# EAGLE design MAX30100_Adapter (EAGLE 7.3.0)
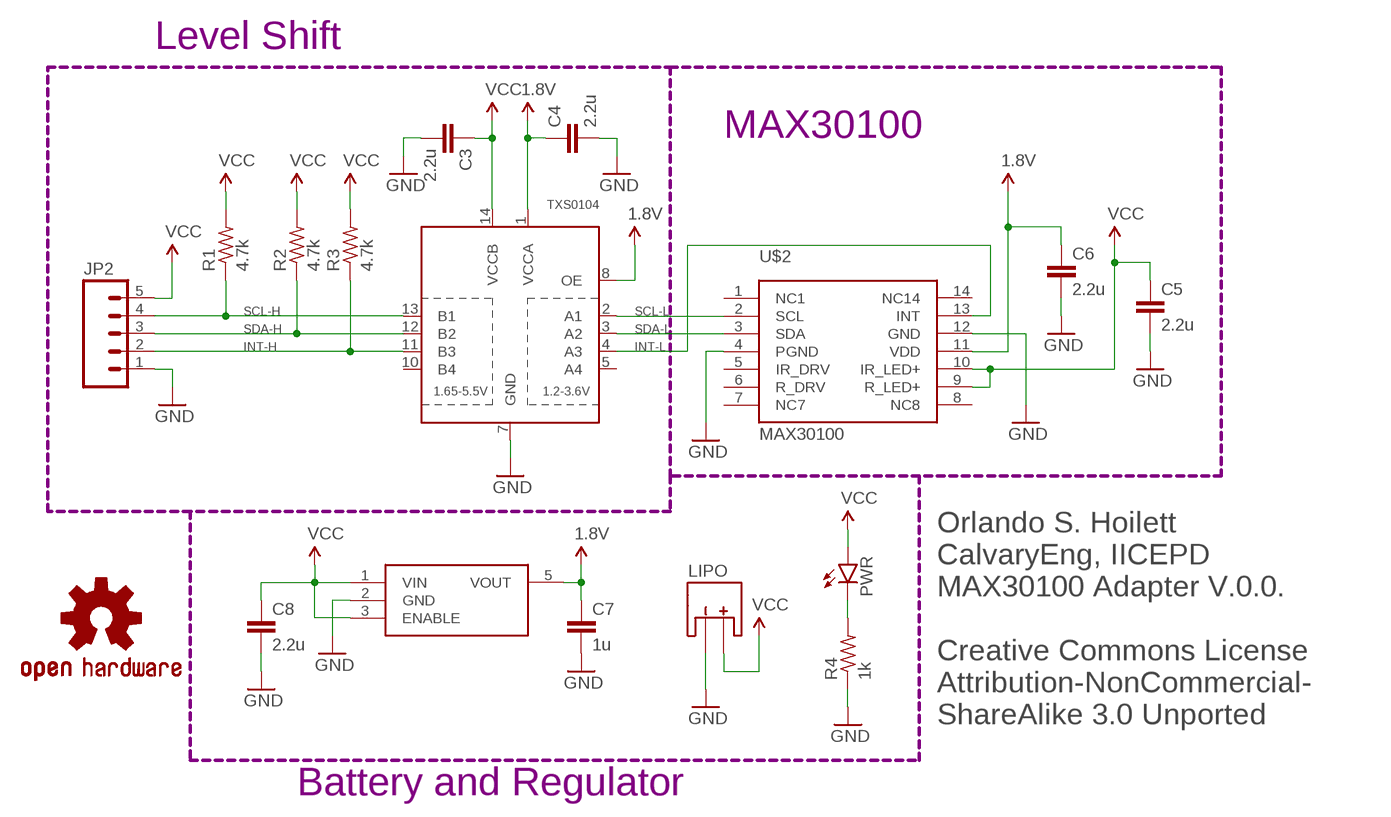
[diagram p0: schematic, sheet 1]

## Parts
C3  2.2u  C-EUC0402  [C0402]
C4  2.2u  C-EUC0402  [C0402]
C5  2.2u  C-EUC0402  [C0402]
C6  2.2u  C-EUC0402  [C0402]
C7  1u  C-EUC0402  [C0402]
C8  2.2u  C-EUC0402  [C0402]
JP2  M05NO_SILK  [1X05_NO_SILK]
LDO  MIC5504  [SOT23-5]
LIPO  JST-PTH  [JST-2-PTH-VERT]
LOGO1  OSHW-LOGOS  [OSHW-LOGO-S]
PWR  LED0603  [LED-0603]
R1  4.7k  R-US_R0402  [R0402]
R2  4.7k  R-US_R0402  [R0402]
R3  4.7k  R-US_R0402  [R0402]
R4  1k  R-US_R0402  [R0402]
TXS0104  TXB0104PWR  [TSSOP14]
U$2  MAX30100  [OESIP14]

## Nets
1.8V: C4.1 C6.1 C7.1 LDO.5(VOUT) TXS0104.1(VCCA) TXS0104.8(OE) U$2.11(VDD)
GND: C3.2 C4.2 C5.2 C6.2 C7.2 C8.2 JP2.1 LDO.2(GND) LIPO.- R4.1 TXS0104.7(GND) U$2.4(PGND) U$2.12(GND)
INT-H: JP2.2 R3.1 TXS0104.11(B3)
INT-L: TXS0104.4(A3) U$2.13(INT)
N$1: PWR.C R4.2
SCL-H: JP2.4 R1.1 TXS0104.13(B1)
SCL-L: TXS0104.2(A1) U$2.2(SCL)
SDA-H: JP2.3 R2.1 TXS0104.12(B2)
SDA-L: TXS0104.3(A2) U$2.3(SDA)
VCC: C3.1 C5.1 C8.1 JP2.5 LDO.1(VIN) LDO.3(ENABLE) LIPO.+ PWR.A R1.2 R2.2 R3.2 TXS0104.14(VCCB) U$2.9(R_LED+) U$2.10(IR_LED+)
Unconnected: TXS0104.5(A4) TXS0104.10(B4) U$2.1(NC1) U$2.5(IR_DRV) U$2.6(R_DRV) U$2.7(NC7) U$2.8(NC8) U$2.14(NC14)

## Notes on the sheet
- Level Shift
- MAX30100
- Orlando S. Hoilett
  CalvaryEng, IICEPD
  MAX30100 Adapter V.0.0.
  
  Creative Commons License
  Attribution-NonCommercial-
  ShareAlike 3.0 Unported
- Battery and Regulator

## Library data of the parts
C3-C8 = resistor:C-EU: CAPACITOR, European symbol
JP2 = SparkFun-Connectors:M05: Header 5 Standard 5-pin 0.1" header. Use with straight break away headers (SKU : PRT-00116), right angle break away headers (PRT-00553), swiss pins (PRT-00743), machine pins (PRT-00117), and female headers (PRT-00115). Molex polarized connector foot print use with SKU : PRT-08230 with associated crimp pins and housings.
LDO = OrlandoRonMod:MIC5504
LIPO = Orlando:JST-PTH
LOGO1 = SparkFun-Aesthetics:OSHW-LOGO: Open Source Hardware Logo This logo indicates the piece of hardware it is found on incorporates a OSHW license and/or adheres to the definition of open source hardware found here: http://freedomdefined.org/OSHW
PWR = SparkFun-LED:LED: LEDs Standard schematic elements and footprints for 5mm, 3mm, 1206, and 0603 sized LEDs. 5mm - Spark Fun Electronics SKU : COM-00529 (and others)
R1-R4 = resistor:R-US_: RESISTOR, American symbol
TXS0104 = SparkFun-DigitalIC:TXB0104PWR: 4-Bit Bi-Directional Level Shifter 1.2V-3.6V (VCCA) to 1.65V-5.5V (VCCB) bi-directional level shifter with auto direction sensing. Max data rate - VCCA 1.8V: 20Mbps (50ns), VCCA 3.3V: 100Mbps (10ns) Digikey: 296-21929-1-ND (TSSOP) IC-11329
U$2 = OrlandoRonMod:MAX30100

## Board
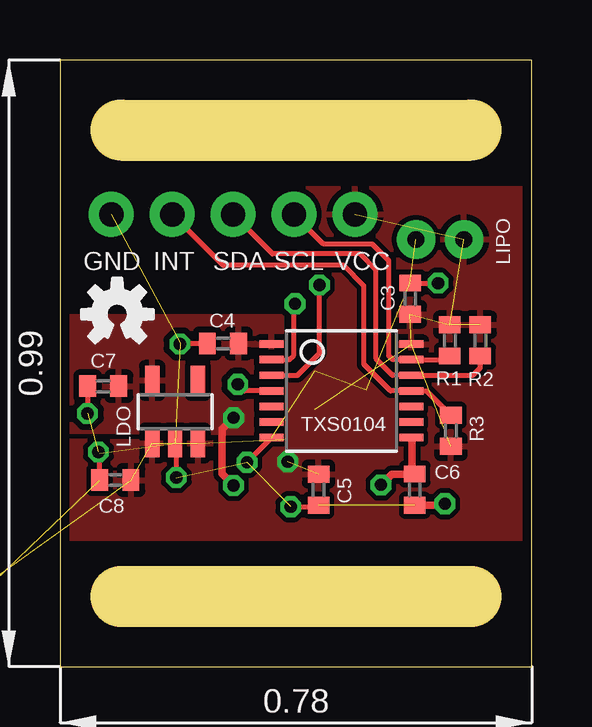
[diagram p1: board, top side]
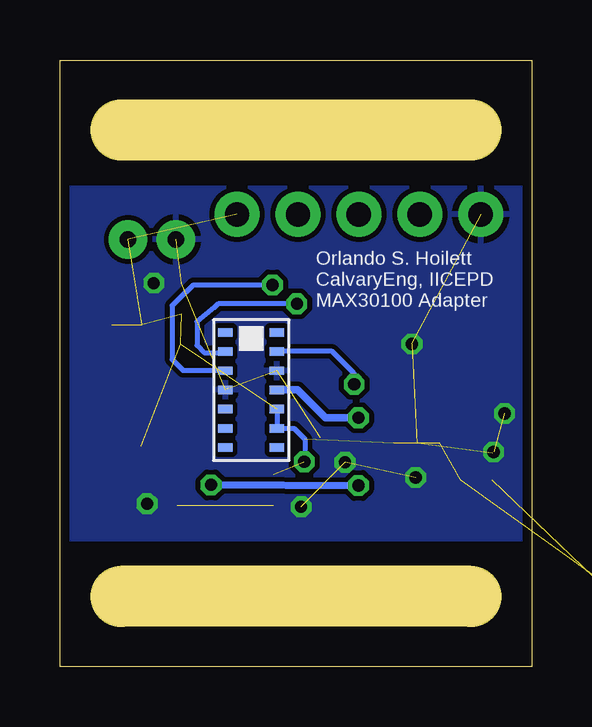
[diagram p2: board, bottom side, seen from below]

Size 19.68 x 25.27 mm. Coordinates in mm from the lower left corner, seen from the top.
Outline: 2.54,22.35 17.14,22.35
Outline: 2.54,2.92 17.14,2.92
Outline: 0,0 19.68,0 19.68,25.27 0,25.27 0,0
Copper layers (1*16): Top 0.0356mm / dielectric 1.5011mm / Bottom 0.0356mm
Design rules "LaenPCBOrder": minimum track width 6mil, minimum drill 13mil, track to track 6mil, track to pad 6mil, pad to pad 6mil, via to via 6mil, smd to smd 6mil, copper to edge 15mil, drill to drill 6mil, minimum pad ring 7mil, minimum via ring 7mil, stop-mask expansion 3mil, vias tented up to drill 0mil, thermal gap 10mil

### Footprints (pad centres in the part's own frame; a part is rotated, then mirrored left to right if it is on the bottom)
C0402 = smd 0.7 x 0.9: 1 -0.65,0; 2 0.65,0
1X05_NO_SILK = drill 1.016 pad 1.88: 1 0,0; 2 2.54,0; 3 5.08,0; 4 7.62,0; 5 10.16,0
SOT23-5 = smd 0.6 x 1.2: 1 -0.95,-1.306; 2 0,-1.306; 3 0.95,-1.306; 4 0.95,1.306; 5 -0.95,1.306
JST-2-PTH-VERT = drill 0.7 pad 1.6: + 1,-0.55; - -1,-0.55
LED-0603 = smd 1 x 1: A 0,-0.677; C 0,0.877
R0402 = smd 0.7 x 0.9: 1 -0.65,0; 2 0.65,0
TSSOP14 = smd 0.305 x 0.991: 1 -1.95,-2.918; 2 -1.3,-2.918; 3 -0.65,-2.918; 4 0,-2.918; 5 0.65,-2.918; 6 1.3,-2.918; 7 1.95,-2.918; 8 1.95,2.918; 9 1.3,2.918; 10 0.65,2.918; 11 0,2.918; 12 -0.65,2.918; 13 -1.3,2.918; 14 -1.95,2.918
OESIP14 = smd 0.6 x 0.35: 1 -1.08,2.54; 2 -1.08,1.74; 3 -1.08,0.94; 4 -1.08,0.14; 5 -1.08,-0.66; 6 -1.08,-1.46; 7 -1.08,-2.26; 8 1.07,-2.26; 9 1.07,-1.46; 10 1.07,-0.66; 11 1.07,0.14; 12 1.07,0.94; 13 1.07,1.74; 14 1.07,2.54

### Placement (x,y rotation side)
C3  14.6,15.33 90 top
C4  6.8,13.46 180 top
C5  10.78,7.37 270 top
C6  14.79,7.37 270 top
C7  1.8,11.68 180 top
C8  2.31,7.77 180 top
JP2  2.14,18.84 0 top
LDO  4.8,10.62 0 top
LIPO  15.85,18.35 0 top
LOGO1  2.39,14.68 0 top
PWR  -12.73,-2.79 0 top  (outside the outline)
R1  16.26,13.59 90 top
R2  17.53,13.59 90 top
R3  16.3,9.82 270 top
R4  -12.8,-6.68 0 top  (outside the outline)
TXS0104  11.74,11.49 270 top
U$2  11.71,11.38 0 bottom

### Tracks (layer width: path | path; a pad name or v marks a point on that pad's centre or on a via)
1.8V  (via drill 0.51)
  Top 0.305: v7.24,7.54 6.76,8.03 6.76,9.88 v7.24,10.36 | TXS0104.8 14.69,9.51 14.69,8.13 C6.1 13.84,8.02 v13.39,7.57
  Bottom 0.305: U$2.11 9.77,11.52 8.61,10.36 v7.24,10.36 | v13.39,7.57 v7.24,7.54
  pour Top (isolate 0.254): 0,14.61 9.25,14.61 9.25,9.7 0,9.78
GND  (via drill 0.51)  (12 unrouted)
  Top 0.203: LDO.2 4.85,9.31 v4.85,7.87 | TXS0104.7 v7.8,8.51 | C3.2 15.68,15.98 v15.77,15.98 | v9.63,6.65 10.72,6.65 C5.2 | C7.2 1.15,10.55 v1.14,10.54 | C8.2 1.66,8.88 v1.6,8.94 | C4.2 5.03,13.46 v5,13.44
  Top 0.305: C6.2 15.99,6.72 v16.05,6.78
  pour Bottom (isolate 0.203): 19.68,19.94 19.68,5.33 0,5.33 0,19.94
INT-H
  Top 0.203: JP2.2 6.81,16.71 11.84,16.71 12.68,15.88 12.68,12.6 13.79,11.49 TXS0104.11 15.29,11.49 R3.1
INT-L  (via drill 0.51)
  Top 0.203: TXS0104.4 7.69,11.49 v7.42,11.76
  Bottom 0.203: v7.42,11.76 7.42,12.22 8.33,13.13 10.63,13.13 U$2.13
N$1  (1 unrouted)
SCL-H
  Top 0.203: JP2.4 11,17.6 13.03,17.6 13.72,16.92 13.72,12.95 13.88,12.79 TXS0104.13 16.1,12.79 R1.1
SCL-L  (via drill 0.51)
  Top 0.203: TXS0104.2 9.56,12.79 9.75,12.98 9.75,15.06 v9.8,15.11
  Bottom 0.203: U$2.2 12.83,13.08 13.66,13.08 13.97,13.39 13.97,14.38 13.23,14.96 13.08,15.11 v9.8,15.11
SDA-H
  Top 0.203: JP2.3 8.86,17.2 12.52,17.2 13.18,16.54 13.18,12.83 13.87,12.14 TXS0104.12 17.22,12.14 17.53,12.45 R2.1
SDA-L  (via drill 0.51)
  Top 0.203: TXS0104.3 9.9,12.14 10.82,13.06 v10.82,15.9
  Bottom 0.203: U$2.3 12.81,12.34 14.55,12.34 15.01,12.8 15.01,15.04 14.43,15.62 14.4,15.62 14.12,15.9 v10.82,15.9
VCC  (via drill 0.51)  (12 unrouted)
  Bottom 0.203: U$2.10 U$2.9 9.92,9.92 9.47,9.47 9.47,8.56 v9.5,8.53
  pour Top (isolate 0.203, rank 2): 0,19.94 19.68,19.94 19.68,5.33 0,5.33

### Text on the board
Dimension: Cut-out | Cut-out
bPlace: Orlando S. Hoilett / CalvaryEng, IICEPD / MAX30100 Adapter
_tsilk: GND | INT | SDA | SCL | VCC | Creative Commons License / Attribution-NonCommercial- / ShareAlike 3.0 Unported